# Altium schematic sheet ESP32.SchDoc
size 431 x 279 mm; Organization: ORGANIZATION; Address1: ADDRESS 1; Address2: ADDRESS 2; Address3: ADDRESS 3; Address4: ADDRESS 4; Revision: -; SheetNumber: 2; SheetTotal: 6; ENG_APP_DATE: --/--/--; DSN_APP_DATE: --/--/--; CHK_APP_DATE: --/--/--
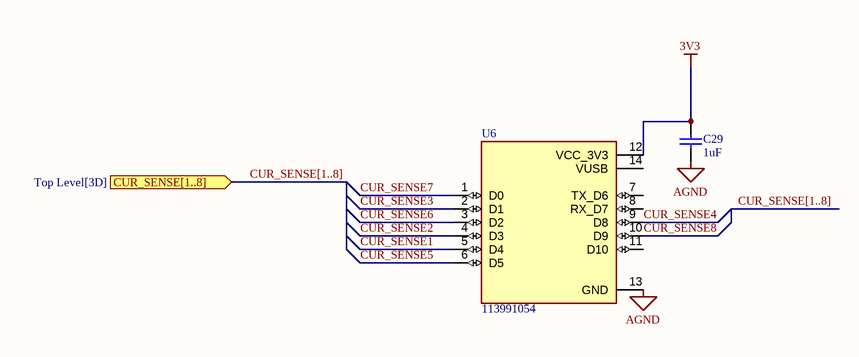
[diagram p0: ESP32.SchDoc]

## Parts
C29  1uF  [0603]
U6  113991054  [113991054]

## Ports
CUR_SENSE[1..8] (in, see Top Level[3D])

## Nets
3V3: C29.2 U6.12(VCC_3V3)
AGND: C29.1 U6.13(GND)
CUR_SENSE1: U6.5(D4)
CUR_SENSE2: U6.4(D3)
CUR_SENSE3: U6.2(D1)
CUR_SENSE4: U6.9(D8)
CUR_SENSE5: U6.6(D5)
CUR_SENSE6: U6.3(D2)
CUR_SENSE7: U6.1(D0)
CUR_SENSE8: U6.10(D9)

Not connected (* = marked no-connect by the designer): U6 7(TX_D6) 8(RX_D7) 11(D10) 14(VUSB)

## Buses and harness runs
bus CUR_SENSE[1..8]
bus CUR_SENSE[1..8] = port CUR_SENSE[1..8]

## Notes on the sheet
- DWG. NO.
- REV.
- SHT.
- THIS DOCUMENT AND THE DATA DISCLOSED HEREIN OR HEREWITH IS THE PROPERTY OF ALTIUM LIMITED AND MAY BE FREELY DISTRIBUTED IN WHOLE. NO RIGHTS ARE RESERVED OR EXPRESS OR IMPLIED WARANTEE GIVEN.
- REVISION
- DESCRIPTION
- DATE
- APPROVED
- ENG:
- APPROVALS
- PROJECT
- DSN:
- CHK:
- REFERENCE DOCUMENTS
- PROJECT REVISION:
- TITLE
- DOCUMENT REVISION:
- DESIGN ITEM:
- BOM:
- FAB DWG:
- PCB DWG:
- ASSY DWG:
- SCALE:
- SIZE
- B
- CAGE CODE
- FILE NAME
- DWG NO.
- SHEET
- OF
- REV

## Library data of the parts
C29 = C TBD 0603
U6 = 113991054: - ESP32-C3 Transceiver; 802.11 a/b/g/n (Wi-Fi, WiFi, WLAN), BluetoothÂ® Smart 4.x Low Energy (BLE) 2.4GHz Evaluation Board; MF: Seeed Technology Co., Ltd; Price: None; Availability: In Stock; Package: None; Check_prices: https://www.snapeda.com/parts/113991054/Seeed+Technology+Co.%252C+Ltd/view-part/?ref=eda; MP: 113991054; Value: *; SnapEDA_Link: https://www.snapeda.com/parts/113991054/Seeed+Technology+Co.%252C+Ltd/view-part/?ref=snap; Purchase-URL: https://pricing.snapeda.com/search/part/113991054/?ref=eda